# Altium schematic sheet HW_Mechanical_Parts.SchDoc: HW Mechanical parts
size A4; SheetNumber: 19; SheetTotal: 19
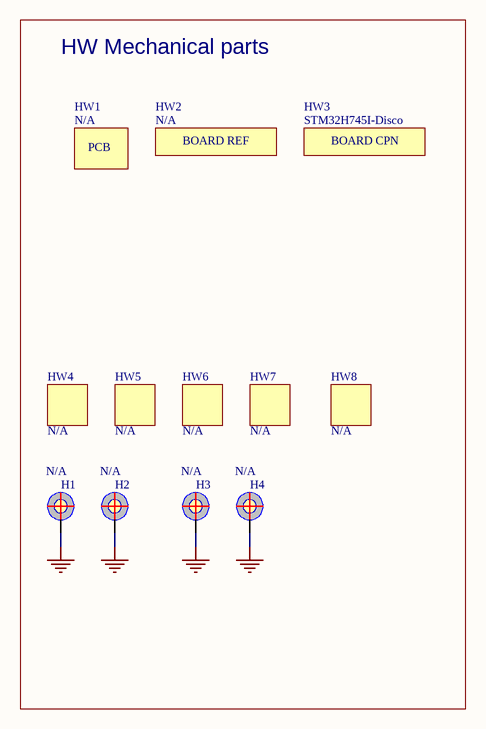
[diagram p0: HW_Mechanical_Parts.SchDoc]

## Parts
H1  POSITION HOLE C7D3R5  [PTH_350_700]  (value not drawn)  (no BOM)
H2  POSITION HOLE C7D3R5  [PTH_350_700]  (value not drawn)  (no BOM)
H3  POSITION HOLE C7D3R5  [PTH_350_700]  (value not drawn)  (no BOM)
H4  POSITION HOLE C7D3R5  [PTH_350_700]  (value not drawn)  (no BOM)
HW1  PCB  (value not drawn)  (no BOM)
HW2  STICKER_BOARD_REF  (value not drawn)  (no BOM)
HW3  value STM32H745I-Disco  (hidden comment: STICKER_BOARD_CPN)  (no BOM)
HW4  Logo  [LOGO_STM_BIG]  (value not drawn)  (no BOM)
HW5  Logo  [LOGO_CE]  (value not drawn)  (no BOM)
HW6  Logo  [LOGO_MAIN_1]  (value not drawn)  (no BOM)
HW7  Logo  [LOGO_ROHS]  (value not drawn)  (no BOM)
HW8  Logo  [LOGO_STM32]  (value not drawn)  (no BOM)

## Blocks framed on the sheet
HW Mechanical parts: H1-H4 HW1-HW8

## Nets
GND: H1.1 H2.1 H3.1 H4.1

## Notes on the sheet
- Title:
- Project:
- Size:
- Revision:
- Variant:
- A4
- -
- Date:
- Reference:
- Sheet:
- of
- (in symbol MCD-00235) BOARD REF
- (in symbol MCD-00549) BOARD CPN

## Library data of the parts
H1-H4 = MCD-00328: Part_Type: Misc; Part_Preference: Recommended; Initial_Board_Reference: MB1311; ID: 2950; ShowFields: YES; Component_Country_Of_Origin: Unknown; Internal_Part_Number: MCD-00328; Status: Released; ECCN_US: n/a; ECCN_EU: n/a; Provided_By: n/a; Manufacturer: N/A; Manufacturer_Part_Number: N/A; Order_Code_Digikey: N/A; Order_Code_Farnell: N/A; Order_Code_RS: N/A; Value: N/A; ComponentLink1URL: http://tunmcdsvn.tun.st.com/Component_Documentation_Library/Trunk; Manufacturer_HQ_COO: Unknown
HW1 = MCD-00036: PCB, xxxx for PCB ref, Y for revision; Part_Type: Misc; Part_Preference: Forbidden; Provided_By: Subcon; Initial_Board_Reference: MB1274; Component_Country_Of_Origin: Unknown; ID: 2481; ShowFields: YES; Internal_Part_Number: MCD-00036; Value: N/A; Status: Released; ECCN_US: n/a; ECCN_EU: n/a; Manufacturer: N/A; Manufacturer_HQ_COO: Unknown; Manufacturer_Part_Number: n/a; Order_Code_Digikey: N/A; Order_Code_Farnell: N/A; Order_Code_RS: N/A; ComponentLink1URL: http://tunmcdsvn.tun.st.com/Component_Documentation_Library/Trunk
HW2 = MCD-00235: Sticker to mention board reference + serial number; Part_Type: Misc; Part_Preference: Recommended; Provided_By: Subcon; Initial_Board_Reference: mb1319; ID: 2632; ShowFields: YES; Component_Country_Of_Origin: Unknown; Internal_Part_Number: MCD-00235; Value: N/A; ECCN_US: n/a; ECCN_EU: n/a; Status: Released; ComponentLink1URL: http://tunmcdsvn.tun.st.com/Component_Documentation_Library/Trunk; Manufacturer: N/A; Manufacturer_Part_Number: N/A; Order_Code_Digikey: N/A; Order_Code_Farnell: N/A; Order_Code_RS: N/A
HW3 = MCD-00549: Sticker to mention board CPN code; Part_Type: Mechanical; Provided_By: Subcon; Initial_Board_Reference: mb1319; Internal_Part_Number: MCD-00549; ECCN_US: n/a; ECCN_EU: n/a; Status: Released
HW4 = MCD-00625: "STMicroelectronics" logo footprint for PCB; Part_Type: Misc; Part_Preference: Forbidden; Initial_Board_Reference: MB1331; ID: 3117; ShowFields: YES; Component_Country_Of_Origin: Unknown; Internal_Part_Number: MCD-00625; Value: N/A; Status: Obsolete; Manufacturer_Part_Number: n/a; Manufacturer: n/a; ComponentLink1Description: n/a; ComponentLink1URL: http://tunmcdsvn.tun.st.com/Component_Documentation_Library/Trunk/Misc; ECCN_US: n/a; ECCN_EU: n/a; Provided_By: n/a; Order_Code_Digikey: N/A; Order_Code_Farnell: N/A; Order_Code_RS: N/A; Manufacturer_HQ_COO: Unknown
HW5 = MCD-00626: "CE" logo footprint for PCB; Part_Type: Misc; Part_Preference: Forbidden; Initial_Board_Reference: mb1331; ID: 3116; ShowFields: YES; Component_Country_Of_Origin: Unknown; Internal_Part_Number: MCD-00626; Value: N/A; Status: Obsolete; ECCN_US: n/a; ECCN_EU: n/a; Provided_By: n/a; Manufacturer: N/A; Manufacturer_Part_Number: N/A; Order_Code_Digikey: N/A; Order_Code_Farnell: N/A; Order_Code_RS: N/A; ComponentLink1URL: http://tunmcdsvn.tun.st.com/Component_Documentation_Library/Trunk; Manufacturer_HQ_COO: Unknown
HW6 = MCD-00627: "Hand" ESD logo footprint for PCB; Part_Type: Misc; Part_Preference: Forbidden; Initial_Board_Reference: MB1331; ID: 3114; ShowFields: YES; Component_Country_Of_Origin: Unknown; Internal_Part_Number: MCD-00627; Value: N/A; Status: Obsolete; Manufacturer_Part_Number: n/a; Manufacturer: n/a; ComponentLink1Description: n/a; ComponentLink1URL: http://tunmcdsvn.tun.st.com/Component_Documentation_Library/Trunk/Misc; ECCN_US: n/a; ECCN_EU: n/a; Provided_By: n/a; Order_Code_Digikey: N/A; Order_Code_Farnell: N/A; Order_Code_RS: N/A; Manufacturer_HQ_COO: Unknown
HW7 = MCD-00628: "ROHS" logo footprint for PCB; Part_Type: Misc; Part_Preference: Forbidden; Initial_Board_Reference: mb1331; ID: 3120; ShowFields: YES; Component_Country_Of_Origin: Unknown; Internal_Part_Number: MCD-00628; Value: N/A; Status: Obsolete; ECCN_US: n/a; ECCN_EU: n/a; Provided_By: n/a; Manufacturer: N/A; Manufacturer_Part_Number: N/A; Order_Code_Digikey: N/A; Order_Code_Farnell: N/A; Order_Code_RS: N/A; ComponentLink1URL: http://tunmcdsvn.tun.st.com/Component_Documentation_Library/Trunk; Manufacturer_HQ_COO: Unknown
HW8 = MCD-00629: STM32 logo footprint for PCB; Part_Type: Misc; Part_Preference: Forbidden; Initial_Board_Reference: MB1331; Path: ws/MCD_ApplicationBoards/Lists/MCDPARTSdatabase; Item Type: Item; ID: 3119; ShowFields: YES; Component_Country_Of_Origin: Unknown; Internal_Part_Number: MCD-00629; Value: N/A; Status: Obsolete; ComponentLink1Description: Datasheet; Provided_By: n/a; Manufacturer: N/A; Manufacturer_Part_Number: N/A; Order_Code_Digikey: N/A; Order_Code_Farnell: N/A; Order_Code_RS: N/A; ComponentLink1URL: http://tunmcdsvn.tun.st.com/Component_Documentation_Library/Trunk; Manufacturer_HQ_COO: Unknown